# Altium schematic sheet Sheet1.SchDoc
size A4
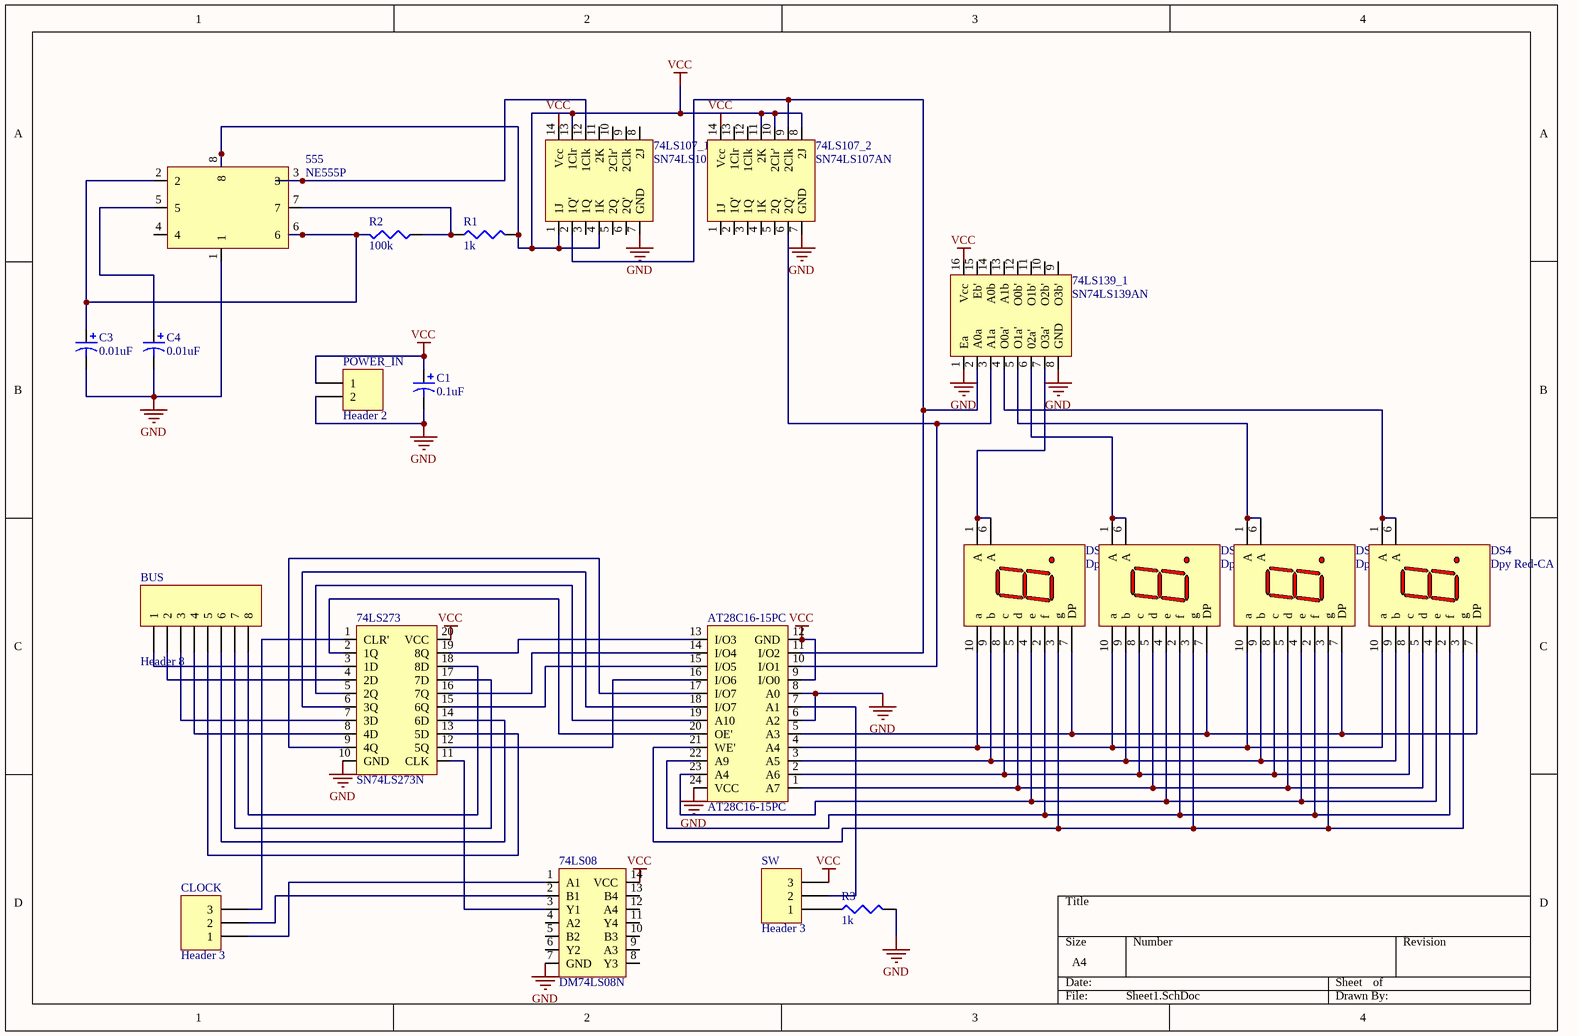
[diagram p0: Sheet1.SchDoc]

## Parts
74LS08  DM74LS08N  [SN74LS08N]
74LS107_1  SN74LS107AN  [DM74LS107]
74LS107_2  SN74LS107AN  [DM74LS107]
74LS139_1  SN74LS139AN  [SN74LS139AN]
74LS273  SN74LS273N  [SN74LS273N]
555  NE555P  [LM555]
AT28C16-15PC  AT28C16-15PC  [AT28C16-15PC]
BUS  Header 8  [HDR1X8]
C1  0.1uF  [C0805]
C3  0.01uF  [C0805]
C4  0.01uF  [C0805]
CLOCK  Header 3  [HDR1X3]
DS1  Dpy Red-CA  [7-segment]
DS2  Dpy Red-CA  [7-segment]
DS3  Dpy Red-CA  [7-segment]
DS4  Dpy Red-CA  [7-segment]
POWER_IN  Header 2  [HDR1X2]
R1  1k  [6-0805_L]
R2  100k  [6-0805_L]
R3  1k  [6-0805_L]
SW  Header 3  [HDR1X3]

## Nets
GND: 74LS08.7(GND) 74LS107_1.7(GND) 74LS107_2.7(GND) 74LS139_1.1(Ea) 74LS139_1.8(GND) 74LS273.10(GND) 555.1 AT28C16-15PC.6(A2) AT28C16-15PC.8(A0) AT28C16-15PC.24(VCC) C1.2 C3.2 C4.2 POWER_IN.2 R3.2
VCC: 74LS08.14(VCC) 74LS107_1.1(1J) 74LS107_1.4(1K) 74LS107_1.13(1Clr) 74LS107_1.14(Vcc) 74LS107_2.8(2J) 74LS107_2.10(2Clr') 74LS107_2.11(2K) 74LS107_2.14(Vcc) 74LS139_1.16(Vcc) 74LS273.20(VCC) 555.8 AT28C16-15PC.9(I/O0) AT28C16-15PC.12(GND) C1.1 POWER_IN.1 R1.2 SW.3
Net74LS08_1: 74LS08.1(A1) CLOCK.1
Net74LS08_2: 74LS08.2(B1) CLOCK.2
Net74LS08_3: 74LS08.3(Y1) 74LS273.11(CLK)
Net74LS107_1_2: 74LS107_1.2(1Q') 74LS107_2.9(2Clk) 74LS139_1.2(A0a) AT28C16-15PC.11(I/O2)
Net74LS107_1_12: 74LS107_1.12(1Clk) 555.3
Net74LS107_2_6: 74LS107_2.6(2Q') 74LS139_1.3(A1a) AT28C16-15PC.10(I/O1)
Net74LS139_1_4: 74LS139_1.4(O0a') DS4.1(A) DS4.6(A)
Net74LS139_1_5: 74LS139_1.5(O1a') DS3.1(A) DS3.6(A)
Net74LS139_1_6: 74LS139_1.6(02a') DS2.1(A) DS2.6(A)
Net74LS139_1_7: 74LS139_1.7(O3a') DS1.1(A) DS1.6(A)
Net74LS273_1: 74LS273.1(CLR') CLOCK.3
Net74LS273_2: 74LS273.2(1Q) AT28C16-15PC.20(OE')
Net74LS273_3: 74LS273.3(1D) BUS.1
Net74LS273_4: 74LS273.4(2D) BUS.2
Net74LS273_5: 74LS273.5(2Q) AT28C16-15PC.19(A10)
Net74LS273_6: 74LS273.6(3Q) AT28C16-15PC.18(I/O7)
Net74LS273_7: 74LS273.7(3D) BUS.3
Net74LS273_8: 74LS273.8(4D) BUS.4
Net74LS273_9: 74LS273.9(4Q) AT28C16-15PC.17(I/O7)
Net74LS273_12: 74LS273.12(5Q) AT28C16-15PC.16(I/O6)
Net74LS273_13: 74LS273.13(5D) BUS.5
Net74LS273_14: 74LS273.14(6D) BUS.6
Net74LS273_15: 74LS273.15(6Q) AT28C16-15PC.15(I/O5)
Net74LS273_16: 74LS273.16(7Q) AT28C16-15PC.14(I/O4)
Net74LS273_17: 74LS273.17(7D) BUS.7
Net74LS273_18: 74LS273.18(8D) BUS.8
Net74LS273_19: 74LS273.19(8Q) AT28C16-15PC.13(I/O3)
Net555_2: 555.2 555.6 C3.1 R2.2
Net555_5: 555.5 C4.1
Net555_7: 555.7 R1.1 R2.1
NetAT28C16-15PC_1: AT28C16-15PC.1(A7) DS1.5(d) DS2.5(d) DS3.5(d) DS4.5(d)
NetAT28C16-15PC_2: AT28C16-15PC.2(A6) DS1.8(c) DS2.8(c) DS3.8(c) DS4.8(c)
NetAT28C16-15PC_3: AT28C16-15PC.3(A5) DS1.9(b) DS2.9(b) DS3.9(b) DS4.9(b)
NetAT28C16-15PC_4: AT28C16-15PC.4(A4) DS1.10(a) DS2.10(a) DS3.10(a) DS4.10(a)
NetAT28C16-15PC_5: AT28C16-15PC.5(A3) DS1.7(DP) DS2.7(DP) DS3.7(DP) DS4.7(DP)
NetAT28C16-15PC_7: AT28C16-15PC.7(A1) SW.2
NetAT28C16-15PC_21: AT28C16-15PC.21(WE') DS1.3(g) DS2.3(g) DS3.3(g) DS4.3(g)
NetAT28C16-15PC_22: AT28C16-15PC.22(A9) DS1.2(f) DS2.2(f) DS3.2(f) DS4.2(f)
NetAT28C16-15PC_23: AT28C16-15PC.23(A4) DS1.4(e) DS2.4(e) DS3.4(e) DS4.4(e)
NetR3_1: R3.1 SW.1

Not connected (* = marked no-connect by the designer): 74LS08 4(A2) 5(B2) 6(Y2) 8(Y3) 9(A3) 10(B3) 11(Y4) 12(A4) 13(B4); 74LS107_1 3(1Q) 5(2Q) 6(2Q') 8(2J) 9(2Clk) 10(2Clr') 11(2K); 74LS107_2 1(1J) 2(1Q') 3(1Q) 4(1K) 5(2Q) 12(1Clk) 13(1Clr); 74LS139_1 9(O3b') 10(O2b') 11(O1b') 12(O0b') 13(A1b) 14(A0b) 15(Eb'); 555 4

## Library data of the parts
74LS08 = DM74LS08N: IC GATE AND 4CH 2-INP 14-DIP; Manufacturer: ON Semiconductor / Fairchild; Number of Gates: 4; Propagation Delay: 18ns; Max Supply Voltage: 5.25V; Min Supply Voltage: 4.75V; Number of Inputs: 2; Low Level Output Current: 8mA; High Level Output Current: -400uA; Supplier 1: Mouser; Manufacturer Part Number: DM74LS08N; RoHS: Yes; Category: Logic Gates; Mount: Through Hole; Case/Package: DIP; Number of Pins: 14; Min Operating Temperature: 0°C; Max Operating Temperature: 70°C; Packaging: Rail/Tube; Package Quantity: 25; Number of Circuits: 4; Logic Function: AND; Lead Free: Contains Lead; ComponentLink1URL: https://datasheet.ciiva.com/4825/74ls08-196234-4825713.pdf?src-supplier=Mouser; ComponentLink1Description: https://datasheet.ciiva.com/4825/74ls08-196234-4825713.pdf?src-supplier=Mouser; ComponentLink2URL: https://datasheet.ciiva.com/1877/dm74ls08-1877307.pdf?src-supplier=Digi-Key; ComponentLink2Description: https://datasheet.ciiva.com/1877/dm74ls08-1877307.pdf?src-supplier=Digi-Key; Supplier Part Number 1: 512-DM74LS08N
74LS107_1 74LS107_2 = SN74LS107AN: Flip Flop JK-Type Neg-Edge 2-Element 14-Pin PDIP Tube; Manufacturer: Texas Instruments; Operating Supply Voltage: 5V; Propagation Delay: 20ns; Frequency: 45MHz; Min Supply Voltage: 4.75V; Max Supply Voltage: 5.25V; Number of Elements: 2; Logic Function: Flip-Flop,JK-Type; Clock Edge Trigger Type: Negative Edge,Positive Edge; Output Current: 8mA; Polarity: Non-Inverting; Number of Input Lines: 4; Number of Bits per Element: 1; Turn-On Delay Time: 15ns; High Level Output Current: -400uA; Output Type: TTL; Nominal Supply Current: 100uA; Supplier 1: Newark; Manufacturer Part Number: SN74LS107AN; Stock 1: 0; Mount: Through Hole; Case/Package: PDIP; Number of Pins: 14; Weight: 0.032734oz; Min Operating Temperature: 0°C; Max Operating Temperature: 70°C; Packaging: Rail/Tube; Package Quantity: 25; Number of Circuits: 2; Low Level Output Current: 8mA; Number of Output Lines: 2; Number of Bits: 2; Max Frequency: 45MHz; Length: 19.69mm; Height: 4.57mm; Width: 6.6mm; Radiation Hardening: No; Lead Free: Lead Free; REACH SVHC: No SVHC; ComponentLink1URL: https://www.distrelec.biz/Web/Downloads/_t/ds/sn74ls107a_eng_tds.pdf?mime=application%2Fpdf&src-supplier=Distrelec; ComponentLink1Description: https://www.distrelec.biz/Web/Downloads/_t/ds/sn74ls107a_eng_tds.pdf?mime=application%2Fpdf&src-supplier=Distrelec; ComponentLink2URL: http://focus.ti.com/lit/ds/symlink/sn74107.pdf?src-supplier=Avnet+Europe; ComponentLink2Description: http://focus.ti.com/lit/ds/symlink/sn74107.pdf?src-supplier=Avnet+Europe; ComponentLink3URL: http://www.ti.com/general/docs/lit/getliterature.tsp?genericPartNumber=SN74LS107A&&fileType=pdf&src-supplier=Avnet; ComponentLink3Description: http://www.ti.com/general/docs/lit/getliterature.tsp?genericPartNumber=SN74LS107A&&fileType=pdf&src-supplier=Avnet; ComponentLink4URL: https://source.z2data.com/2016/10/12/6/26/54/563/639426/sn74107.pdf?src-supplier=Digi-Key; ComponentLink4Description: https://source.z2data.com/2016/10/12/6/26/54/563/639426/sn74107.pdf?src-supplier=Digi-Key; ComponentLink5URL: http://www.farnell.com/datasheets/1967736.pdf?src-supplier=Element14; ComponentLink5Description: http://www.farnell.com/datasheets/1967736.pdf?src-supplier=Element14; ComponentLink6URL: https://www.verical.com/server-webapp/html/getDatasheet?partID=250176&src-supplier=Verical; ComponentLink6Description: https://www.verical.com/server-webapp/html/getDatasheet?partID=250176&src-supplier=Verical; Supplier Part Number 1: 95M4428
74LS139_1 = SN74LS139AN: TEXAS INSTRUMENTS         SN74LS139AN            IC, DECODER/DEMUX, 74LS139; Operating Supply Voltage: 5V; Number of Elements: 2; Min Supply Voltage: 4.75V; Max Supply Voltage: 5.25V; Number of Outputs: 4; Propagation Delay: 33ns; Polarity: Inverting; High Level Output Current: -400uA; Low Level Output Current: 8mA; Supply Type: Single; Logic Function: Demultiplexer,Decoder; Turn-On Delay Time: 38ns; Bandwidth: 35MHz; Throw Configuration: DP4T; Nominal Supply Current: 100uA; Max Power Dissipation: 200mW; Supplier 1: RSComponents; Manufacturer: Texas Instruments; Manufacturer Part Number: SN74LS139AN; Stock 1: 0; Mount: Through Hole; Case/Package: PDIP; Number of Pins: 16; Weight: 0.03357oz; Min Operating Temperature: 0°C; Max Operating Temperature: 70°C; Packaging: Rail/Tube; Package Quantity: 25; Number of Inputs: 2; Independent Circuits: 2; Number of Input Lines: 2; Number of Output Lines: 4; Number of Bits: 4; Number of Channels: 2; Number of Circuits: 2; Length: 19.3mm; Height: 4.57mm; Width: 6.35mm; Radiation Hardening: No; Lead Free: Lead Free; REACH SVHC: No SVHC; ComponentLink1URL: http://www.farnell.com/datasheets/2018724.pdf?src-supplier=Element14; ComponentLink1Description: http://www.farnell.com/datasheets/2018724.pdf?src-supplier=Element14; ComponentLink2URL: https://www.distrelec.biz/Web/Downloads/57/06/lm645706.pdf?mime=application%2Fpdf&src-supplier=Distrelec; ComponentLink2Description: https://www.distrelec.biz/Web/Downloads/57/06/lm645706.pdf?mime=application%2Fpdf&src-supplier=Distrelec; ComponentLink3URL: http://www.ti.com/lit/ds/symlink/sn74s139a.pdf?src-supplier=Digi-Key; ComponentLink3Description: http://www.ti.com/lit/ds/symlink/sn74s139a.pdf?src-supplier=Digi-Key; ComponentLink4URL: https://www.verical.com/server-webapp/html/getDatasheet?partID=83287&src-supplier=Verical; ComponentLink4Description: https://www.verical.com/server-webapp/html/getDatasheet?partID=83287&src-supplier=Verical; Supplier Part Number 1: 308253
74LS273 = SN74LS273N: IC D-TYPE POS TRG SNGL 20DIP; Manufacturer: Texas Instruments; Number of Bits: 8; Propagation Delay: 27ns; Frequency: 40MHz; Output Current: 8mA; Polarity: Non-Inverting; Min Supply Voltage: 4.75V; Operating Supply Voltage: 5V; Max Supply Voltage: 5.25V; Number of Elements: 1; Logic Function: D-Type,Flip-Flop; Clock Edge Trigger Type: Positive Edge; Turn-On Delay Time: 17ns; Number of Input Lines: 2; High Level Output Current: -400uA; Output Type: TTL; Supplier 1: RSComponents; Manufacturer Part Number: SN74LS273N; Stock 1: 0; Mount: Through Hole; Case/Package: PDIP; Number of Pins: 20; Weight: 0.042297oz; Min Operating Temperature: 0°C; Max Operating Temperature: 70°C; Packaging: Rail/Tube; Number of Circuits: 8; Package Quantity: 20; Number of Bits per Element: 8; Low Level Output Current: 8mA; Number of Output Lines: 1; Max Frequency: 40MHz; Number of Channels: 8; Length: 24.33mm; Height: 4.57mm; Width: 6.35mm; Radiation Hardening: No; Lead Free: Contains Lead; REACH SVHC: No SVHC; ComponentLink1URL: https://www.distrelec.biz/Web/Downloads/14/_e/kg645614_E.pdf?mime=application%2Fpdf&src-supplier=Distrelec; ComponentLink1Description: https://www.distrelec.biz/Web/Downloads/14/_e/kg645614_E.pdf?mime=application%2Fpdf&src-supplier=Distrelec; ComponentLink2URL: http://focus.ti.com/lit/ds/symlink/sn74273.pdf?src-supplier=Avnet+Europe; ComponentLink2Description: http://focus.ti.com/lit/ds/symlink/sn74273.pdf?src-supplier=Avnet+Europe; ComponentLink3URL: http://www.ti.com/lit/ds/symlink/sn74ls273.pdf?src-supplier=Digi-Key; ComponentLink3Description: http://www.ti.com/lit/ds/symlink/sn74ls273.pdf?src-supplier=Digi-Key; ComponentLink4URL: https://www.verical.com/server-webapp/html/getDatasheet?partID=250181&src-supplier=Verical; ComponentLink4Description: https://www.verical.com/server-webapp/html/getDatasheet?partID=250181&src-supplier=Verical; ComponentLink5URL: http://datasheet.iiic.cc/texas_instruments/SN74LS273N.pdf?src-supplier=IIIC; ComponentLink5Description: http://datasheet.iiic.cc/texas_instruments/SN74LS273N.pdf?src-supplier=IIIC; ComponentLink6URL: http://www.produktinfo.conrad.com/datenblaetter/175000-199999/175129-da-01-en-LOGIK_IC_SN_74_LS_273_N_DIP20__TID.pdf?src-supplier=Conrad; ComponentLink6Description: http://www.produktinfo.conrad.com/datenblaetter/175000-199999/175129-da-01-en-LOGIK_IC_SN_74_LS_273_N_DIP20__TID.pdf?src-supplier=Conrad; ComponentLink7URL: http://www.produktinfo.conrad.com/datenblaetter/1000000-1099999/001016947-da-01-en-IC_DTPE_POS_TRG_S_SN74LS273N_PDIP_20_TID.pdf?src-supplier=Conrad; ComponentLink7Description: http://www.produktinfo.conrad.com/datenblaetter/1000000-1099999/001016947-da-01-en-IC_DTPE_POS_TRG_S_SN74LS273N_PDIP_20_TID.pdf?src-supplier=Conrad; Supplier Part Number 1: 0308354
555 = NE555P: TEXAS INSTRUMENTS         NE555P            TIMER SINGLE PRECISION,DIP8 ,0.5MHZ; Frequency: 500kHz; Quiescent Current: 15mA; Operating Supply Current: 10mA; Min Supply Voltage: 4.5V; Max Supply Voltage: 16V; Nominal Supply Current: 2mA; Number of Timers/Counters: 1; High Level Output Current: -200mA; Low Level Output Current: 200mA; Operating Supply Voltage: 5V; Supplier 1: Digi-Key; Manufacturer: Texas Instruments; Manufacturer Part Number: NE555P; RoHS: Yes; Category: Clock and Timing; Stock 1: 8033; Pricing 1: 1=0,45000, 10=0,34200, 25=0,30800, 100=0,21280, 250=0,17920, 500=0,14560, 1000=0,11200, 2500=0,10080, 5000=0,09520 (USD); Mount: Through Hole; Case/Package: PDIP; Number of Pins: 8; Weight: 0.015535oz; Contact Plating: Gold; Min Operating Temperature: 0°C; Max Operating Temperature: 70°C; Packaging: Rail/Tube; Package Quantity: 50; Current Rating: 10mA; Length: 9.81mm; Height: 4.57mm; Width: 6.35mm; Radiation Hardening: No; Lead Free: Lead Free; REACH SVHC: No SVHC; ComponentLink1URL: https://datasheet.ciiva.com/19457/904085-19457361.pdf?src-supplier=Jameco; ComponentLink1Description: https://datasheet.ciiva.com/19457/904085-19457361.pdf?src-supplier=Jameco; ComponentLink2URL: https://datasheet.ciiva.com/1139/sa555-1139904.pdf?src-supplier=Element14; ComponentLink2Description: https://datasheet.ciiva.com/1139/sa555-1139904.pdf?src-supplier=Element14; ComponentLink3URL: https://datasheet.ciiva.com/26325/152184-da-01-en-ne555p-timer-tid-26325915.pdf?src-supplier=Conrad; ComponentLink3Description: https://datasheet.ciiva.com/26325/152184-da-01-en-ne555p-timer-tid-26325915.pdf?src-supplier=Conrad; ComponentLink4URL: https://datasheet.ciiva.com/1147/1764032-1147750.pdf?src-supplier=Newark; ComponentLink4Description: https://datasheet.ciiva.com/1147/1764032-1147750.pdf?src-supplier=Newark; ComponentLink5URL: https://datasheet.ciiva.com/14094/ne555-series-eng-tds-14094950.pdf?src-supplier=Distrelec; ComponentLink5Description: https://datasheet.ciiva.com/14094/ne555-series-eng-tds-14094950.pdf?src-supplier=Distrelec; ComponentLink6URL: https://datasheet.ciiva.com/14274/ne555-14274456.pdf?src-supplier=Avnet; ComponentLink6Description: https://datasheet.ciiva.com/14274/ne555-14274456.pdf?src-supplier=Avnet; ComponentLink7URL: https://datasheet.ciiva.com/15152/getdatasheetpartid-248510-15152620.pdf?src-supplier=Verical; ComponentLink7Description: https://datasheet.ciiva.com/15152/getdatasheetpartid-248510-15152620.pdf?src-supplier=Verical; ComponentLink8URL: https://datasheet.ciiva.com/1233/ne555-1233454.pdf?src-supplier=Digi-Key; ComponentLink8Description: https://datasheet.ciiva.com/1233/ne555-1233454.pdf?src-supplier=Digi-Key; ComponentLink9URL: https://datasheet.ciiva.com/26228/ne555-26228892.pdf?src-supplier=Avnet+Europe; ComponentLink9Description: https://datasheet.ciiva.com/26228/ne555-26228892.pdf?src-supplier=Avnet+Europe; Supplier Part Number 1: 296-NE555P-ND
AT28C16-15PC = AT28C16-15PC: Manufacturer: Microchip / Atmel; Access Time: 150ns; Operating Supply Voltage: 5V; Nominal Supply Current: 30mA; Min Supply Voltage: 4.5V; Max Supply Voltage: 5.5V; Interface: Parallel; Density: 16Kb; Memory Type: EEPROM; Frequency: 150GHz; Supplier 1: Digi-Key; Manufacturer Part Number: AT28C16-15PC; Stock 1: 0; Mount: Through Hole; Case/Package: DIP; Number of Pins: 24; Min Operating Temperature: 0°C; Max Operating Temperature: 70°C; Package Quantity: 16; Packaging: Rail/Tube; Memory Size: 16Kb; Lead Free: Contains Lead; ComponentLink1URL: http://www.atmel.com/Images/doc0540.pdf?src-supplier=Digi-Key; ComponentLink1Description: http://www.atmel.com/Images/doc0540.pdf?src-supplier=Digi-Key; ComponentLink2URL: http://components.arrow.com/part/dataview/66884S2427492N3744?src-supplier=Arrow; ComponentLink2Description: http://components.arrow.com/part/dataview/66884S2427492N3744?src-supplier=Arrow; Supplier Part Number 1: AT28C16-15PC-ND
BUS = Header 8: Header, 8-Pin; LatestRevisionDate: 17-Jul-2002; LatestRevisionNote: Re-released for DXP Platform.; Publisher: Altium Limited
C1 C3 C4 = Cap Pol3: Polarized Capacitor (Surface Mount); Published: 8-Jun-2000; LatestRevisionDate: 29-May-2009; LatestRevisionNote: IPC-7351 Footprint Added.; PackageReference: C0805; Publisher: Altium Limited; PackageDescription: Chip Capacitor
  C1: Value: 0.1uF
  C3 C4: Value: 0.01uF
CLOCK SW = Header 3: Header, 3-Pin; LatestRevisionDate: 17-Jul-2002; LatestRevisionNote: Re-released for DXP Platform.; Publisher: Altium Limited
DS1-DS4 = Dpy Red-CA: 7.62 mm Black Surface HER 7-Segment Display: CA, RH DP; MinimumIntensity: 360 ucd; Note: IF = 5 mA; Colour: High Efficiency Red (HER); Note: Pins 1 and 6 are redundant Anodes.; Published: 8-Jun-2000; LatestRevisionDate: 17-Dec-2003; LatestRevisionNote: Schematic revised, PCB Footprint replaced.; DatasheetVersion: 19-Feb-2002; PackageVersion: 11-Feb-2002; PackageReference: A; Publisher: Altium Limited; PackageDescription: LED, 7-Segment Display, 7.62 mm, RHD; 10 Leads; Row Space 5.08 mm; Pitch 2.54 mm; ComponentLink1Description: Manufacturer Link; ComponentLink1URL: http://www.agilent.com/
POWER_IN = Header 2: Header, 2-Pin; LatestRevisionDate: 17-Jul-2002; LatestRevisionNote: Re-released for DXP Platform.; Publisher: Altium Limited
R1-R3 = Res3: Resistor; Published: 8-Jun-2000; LatestRevisionDate: 29-May-2009; LatestRevisionNote: IPC-7351 Footprint Added.; PackageReference: J1-0603; Publisher: Altium Limited; PackageDescription: Chip Resistor
  R1 R3: Value: 1K
  R2: Value: 100K